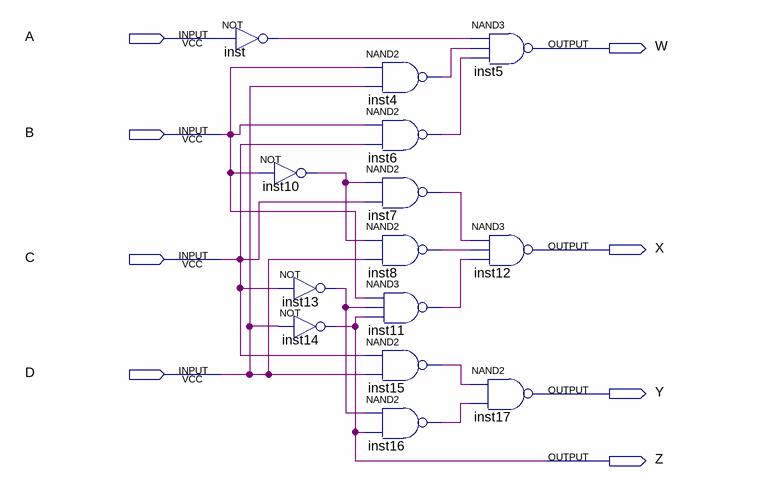
[diagram p0: schematic sheet]
// Quartus schematic Experiment31.bdf as structural Verilog: 14 symbols, 8 pins
module Experiment31 (
  input  A,
  input  B,
  input  C,
  input  D,
  output W,
  output X,
  output Y,
  output Z
);

  wire inst4_out, inst6_out, inst7_out, inst8_out, inst10_out, inst11_out, inst13_out, inst15_out,
       inst16_out, inst_out;

  not inst (inst_out, A);
  not inst10 (inst10_out, B);
  not inst13 (inst13_out, C);
  not inst14 (Z, D);
  nand inst4 (inst4_out, B, D);
  nand inst6 (inst6_out, B, C);
  nand inst7 (inst7_out, inst10_out, C);
  nand inst8 (inst8_out, inst10_out, D);
  nand inst11 (inst11_out, B, inst13_out, Z);
  nand inst15 (inst15_out, C, D);
  nand inst16 (inst16_out, inst13_out, Z);
  nand inst5 (W, inst_out, inst4_out, inst6_out);
  nand inst12 (X, inst7_out, inst8_out, inst11_out);
  nand inst17 (Y, inst15_out, inst16_out);
endmodule
